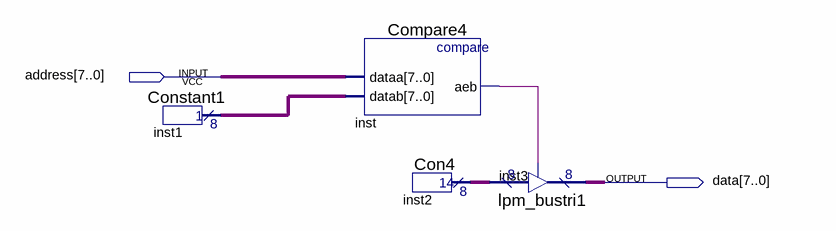
[diagram p0: schematic sheet]
// Quartus schematic Slave4.bdf as structural Verilog: 4 symbols, 2 pins
module Slave4 (
  input  [7:0] address,
  output [7:0] data
);

  wire inst_aeb;
  wire [7:0] inst1_result, inst2_result;

  Constant1 inst1 (.result(inst1_result));
  Compare4 inst (.dataa(address), .datab(inst1_result), .aeb(inst_aeb));
  Con4 inst2 (.result(inst2_result));
  lpm_bustri1 inst3 (.enabledt(inst_aeb), .data(inst2_result), .tridata(data));
endmodule
